# EAGLE design LM317 (EAGLE 9.6.2)
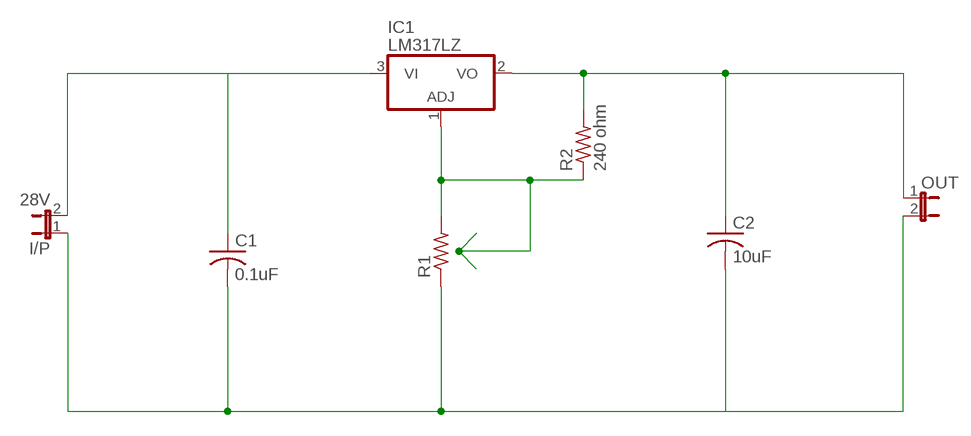
[diagram p0: schematic, sheet 1]

## Parts
C1  0.1uF  C-US025-025X050  [C025-025X050]
C2  10uF  C-US025-025X050  [C025-025X050]
I/P  28V  JP1E  [JP1]
IC1  LM317LZ  [TO92]
OUT  JP1E  [JP1]
R1  R-US_0204/7  [0204/7]
R2  240 ohm  R-US_0204/7  [0204/7]

## Nets
N$1: C1.1 I/P.2 IC1.3(VI)
N$2: C2.1 IC1.2(VO) OUT.1 R2.2
N$3: IC1.1(ADJ) R1.2 R2.1
N$4: C1.2 C2.2 I/P.1 OUT.2 R1.1

## Library data of the parts
C1 C2 = rcl:C-US: CAPACITOR, American symbol; SPICEPREFIX: C
I/P OUT = jumper:JP1E: JUMPER
IC1 = linear:*317: Positive VOLTAGE REGULATOR
R1 R2 = rcl:R-US_: RESISTOR, American symbol; SPICEPREFIX: R

## Board
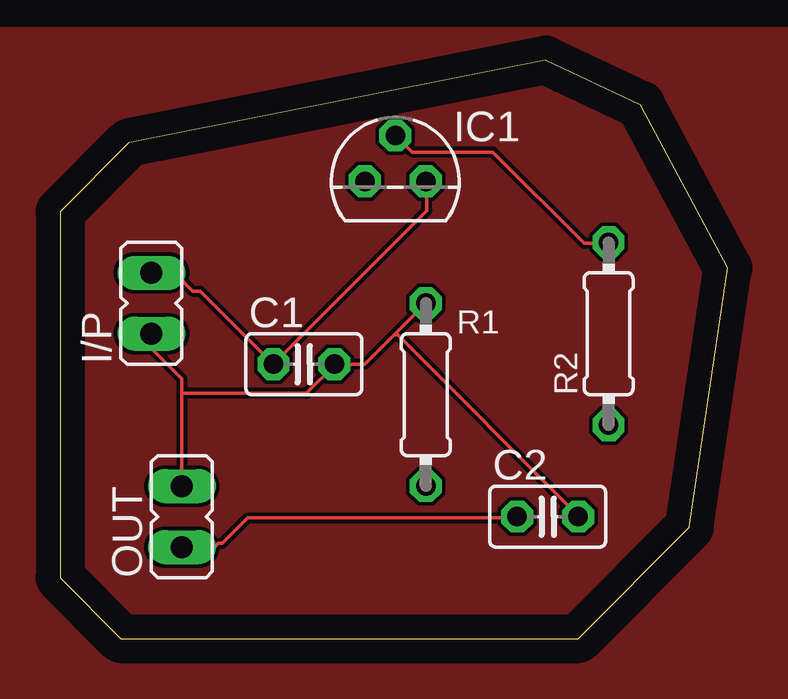
[diagram p1: board, top side]
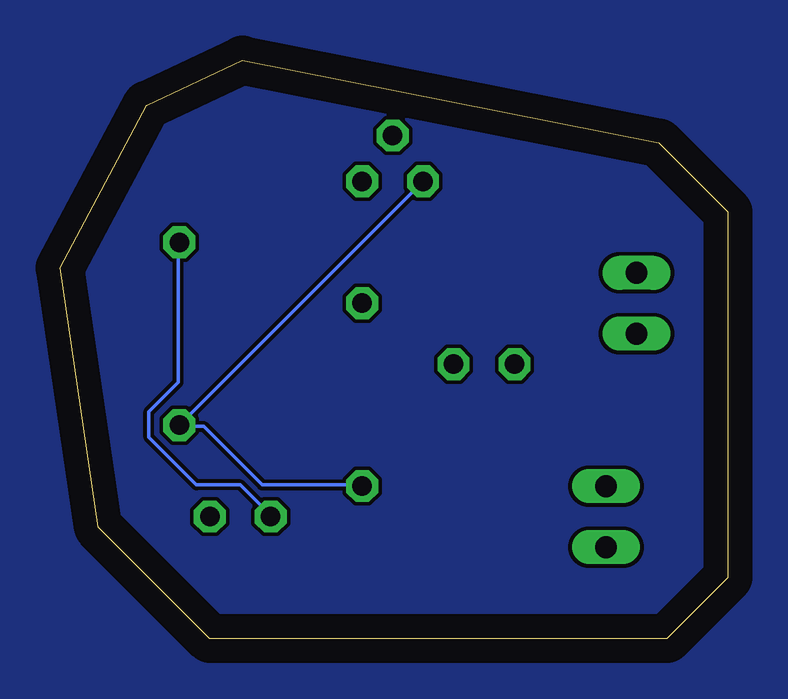
[diagram p2: board, bottom side, seen from below]

Size 27.83 x 24.1 mm. Coordinates in mm from the lower left corner, seen from the top.
Outline: 2.87,20.65 0,17.78 0,2.54 2.54,0 21.59,0 26.23,4.64 27.83,15.45 24.21,22.22 20.23,24.1 2.87,20.65
Copper layers (1*16): Top 0.035mm / dielectric 1.5mm / Bottom 0.035mm
Design rules "default": minimum track width 6mil, minimum drill 0.35mm, track to track 6mil, track to pad 6mil, pad to pad 6mil, via to via 6mil, smd to smd 6mil, copper to edge 40mil, drill to drill 6mil, minimum pad ring 10mil, minimum via ring 8mil, stop-mask expansion 4mil, vias tented up to drill 0mil, thermal gap 10mil

### Footprints (pad centres in the part's own frame; a part is rotated, then mirrored left to right if it is on the bottom)
C025-025X050 = drill 0.813 octagon: 1 -1.27,0; 2 1.27,0
JP1 = drill 0.914 long: 1 0,-1.27; 2 0,1.27
TO92 = drill 0.813 octagon: 1 -1.27,0; 2 0,1.905; 3 1.27,0
0204/7 = drill 0.813 octagon: 1 -3.81,0; 2 3.81,0

### Placement (x,y rotation side)
C1  10.16,11.43 0 top
C2  20.32,5.08 0 top
I/P  3.81,13.97 0 top
IC1  13.97,19.05 0 top
OUT  5.08,5.08 0 top
R1  15.24,10.16 270 top
R2  22.86,12.7 90 top

### Tracks (layer width: path | path; a pad name or v marks a point on that pad's centre or on a via)
GND
  pour Top: -6.35,25.4 31.75,25.4 31.75,-5.08 -6.35,-5.08
  pour Bottom: -6.35,30.48 35.56,30.48 35.56,-12.7 -6.35,-12.7
N$1
  Top 0.152: I/P.2 4.78,15.24 5.54,14.48 5.84,14.48 C1.1 15.29,17.83 15.29,19.05 IC1.3
N$2
  Top 0.152: IC1.2 14.07,20.88 14.68,20.27 18.03,20.27 21.84,16.46 22.76,16.46 R2.2 | OUT.1 6.45,3.81 6.6,3.96 6.76,3.96 7.82,5.03 18.95,5.03 C2.1
  Bottom 0.152: R2.2 22.91,16.46 22.91,10.67 24.13,9.45 24.13,8.38 22.15,6.4 20.32,6.4 19.1,5.18 C2.1
N$3
  Bottom 0.152: R1.2 15.29,6.4 19.41,6.4 21.84,8.84 22.76,8.84 R2.1 IC1.1
N$4
  Top 0.152: 5.08,10.21 5.08,10.82 3.86,12.04 3.86,12.65 I/P.1 | 5.08,10.21 OUT.2 | 11.48,11.43 12.7,11.43 13.92,12.65 | R1.1 13.92,12.65 | 13.92,12.65 14.07,12.65 21.54,5.18 C2.2 | 5.08,10.21 10.26,10.21 11.48,11.43 | 11.48,11.43 C1.2